# Altium project Placa adaptadora TMS320F28335.PrjPcb
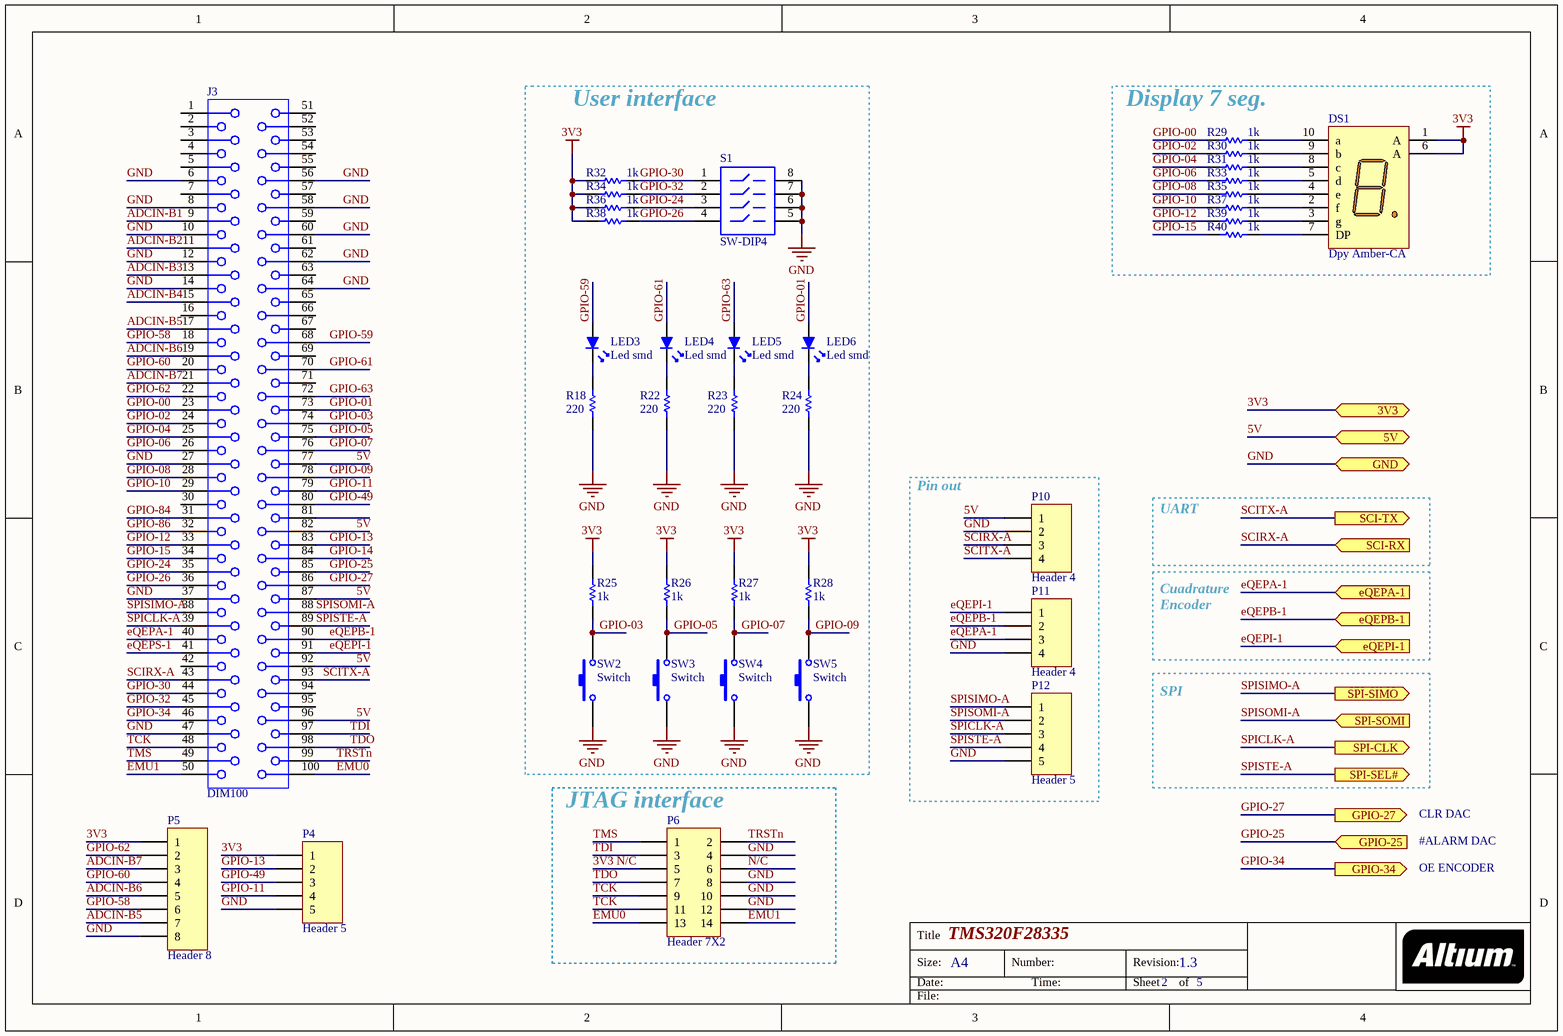
[diagram p0: TMS320F28335.SchDoc]
4 sheets, 107 parts. Net scope: flat (ports and power ports of the same name join across sheets).
Board file: Placa adaptadora TMS320F28335 - PCB.PcbDoc
Sheets:
  TMS320F28335.SchDoc
  Encoder.SchDoc
  DAC.SchDoc
  SupplyPower.SchDoc

## Sheet TMS320F28335.SchDoc: TMS320F28335
size A4; Author: Anderson, Jorge Luis; CompanyName: LEICI - FI-UNLP; Revision: 1.3; SheetNumber: 2; SheetTotal: 5; Number: 1; ProjectName: Placa adaptadora TMS320F28835

### Parts
DS1  Dpy Amber-CA  [A]
J3  DIM100  [390213-1]
LED3  Led smd  [LED 1206]
LED4  Led smd  [LED 1206]
LED5  Led smd  [LED 1206]
LED6  Led smd  [LED 1206]
P4  Header 5  [HDR1X5]
P5  Header 8  [HDR1X8]
P6  Header 7X2  [HDR2X7]
P10  Header 4  [HDR1X4]
P11  Header 4  [HDR1X4]
P12  Header 5  [HDR1X5]
R18  value 220  [R 1206]  (hidden comment: R220)
R22  value 220  [R 1206]  (hidden comment: R220)
R23  value 220  [R 1206]  (hidden comment: R220)
R24  value 220  [R 1206]  (hidden comment: R220)
R25  value 1k  [R 1206]  (hidden comment: R1k)
R26  value 1k  [R 1206]  (hidden comment: R1k)
R27  value 1k  [R 1206]  (hidden comment: R1k)
R28  value 1k  [R 1206]  (hidden comment: R1k)
R29  value 1k  [R 1206]  (hidden comment: R1k)
R30  value 1k  [R 1206]  (hidden comment: R1k)
R31  value 1k  [R 1206]  (hidden comment: R1k)
R32  value 1k  [R 1206]  (hidden comment: R1k)
R33  value 1k  [R 1206]  (hidden comment: R1k)
R34  value 1k  [R 1206]  (hidden comment: R1k)
R35  value 1k  [R 1206]  (hidden comment: R1k)
R36  value 1k  [R 1206]  (hidden comment: R1k)
R37  value 1k  [R 1206]  (hidden comment: R1k)
R38  value 1k  [R 1206]  (hidden comment: R1k)
R39  value 1k  [R 1206]  (hidden comment: R1k)
R40  value 1k  [R 1206]  (hidden comment: R1k)
S1  SW-DIP4  [DIP-8]
SW2  Switch  [TACT SW]
SW3  Switch  [TACT SW]
SW4  Switch  [TACT SW]
SW5  Switch  [TACT SW]

### Blocks framed on the sheet
User interface: LED3-LED6 R18 R22-R28 R32 R34 R36 R38 S1 SW2-SW5
Display 7 seg.: DS1 R29-R31 R33 R35 R37 R39 R40
Pin out: P10-P12
JTAG interface: P6

### Ports
3V3, 5V, eQEPA-1 (in), eQEPB-1 (in), eQEPI-1 (in), GND, GPIO-25 (in), GPIO-27 (out), GPIO-34 (out), SCI-RX (in), SCI-TX (out), SPI-CLK (out), SPI-SEL# (out), SPI-SIMO (out), SPI-SOMI (in)

### Nets
3V3: DS1.1(A) DS1.6(A) P4.1 P5.1 R25.2 R26.2 R27.2 R28.2 R32.1 R34.1 R36.1 R38.1 ; port 3V3
5V: J3.77(p77) J3.82(p82) J3.87(p87) J3.92(p92) J3.96(p96) P10.1 ; port 5V
GND: J3.6(p6) J3.8(p8) J3.10(p10) J3.12(p12) J3.14(p14) J3.27(p27) J3.37(p37) J3.47(p47) J3.56(p56) J3.58(p58) J3.60(p60) J3.62(p62) J3.64(p64) P4.5 P5.8 P6.4 P6.8 P6.10 P6.12 P10.2 P11.4 P12.5 R18.2 R22.2 R23.2 R24.2 S1.5 S1.6 S1.7 S1.8 SW2.1 SW3.1 SW4.1 SW5.1 ; port GND
3V3 N/C: P6.5
ADCIN-B1: J3.9(p9)
ADCIN-B2: J3.11(p11)
ADCIN-B3: J3.13(p13)
ADCIN-B4: J3.15(p15)
ADCIN-B5: J3.17(p17) P5.7
ADCIN-B6: J3.19(p19) P5.5
ADCIN-B7: J3.21(p21) P5.3
EMU0: J3.100(p100) P6.13
EMU1: J3.50(p50) P6.14
eQEPA-1: J3.40(p40) P11.3 ; port eQEPA-1
eQEPB-1: J3.90(p90) P11.2 ; port eQEPB-1
eQEPI-1: J3.91(p91) P11.1 ; port eQEPI-1
eQEPS-1: J3.41(p41)
GPIO-00: J3.23(p23) R29.1
GPIO-01: J3.73(p73) LED6.1(A)
GPIO-02: J3.24(p24) R30.1
GPIO-03: J3.74(p74) R25.1 SW2.2
GPIO-04: J3.25(p25) R31.1
GPIO-05: J3.75(p75) R26.1 SW3.2
GPIO-06: J3.26(p26) R33.1
GPIO-07: J3.76(p76) R27.1 SW4.2
GPIO-08: J3.28(p28) R35.1
GPIO-09: J3.78(p78) R28.1 SW5.2
GPIO-10: J3.29(p29) R37.1
GPIO-11: J3.79(p79) P4.4
GPIO-12: J3.33(p33) R39.1
GPIO-13: J3.83(p83) P4.2
GPIO-14: J3.84(p84)
GPIO-15: J3.34(p34) R40.1
GPIO-24: J3.35(p35) R36.2 S1.3
GPIO-25: J3.85(p85) ; port GPIO-25
GPIO-26: J3.36(p36) R38.2 S1.4
GPIO-27: J3.86(p86) ; port GPIO-27
GPIO-30: J3.44(p44) R32.2 S1.1
GPIO-32: J3.45(p45) R34.2 S1.2
GPIO-34: J3.46(p46) ; port GPIO-34
GPIO-49: J3.80(p80) P4.3
GPIO-58: J3.18(p18) P5.6
GPIO-59: J3.68(p68) LED3.1(A)
GPIO-60: J3.20(p20) P5.4
GPIO-61: J3.70(p70) LED4.1(A)
GPIO-62: J3.22(p22) P5.2
GPIO-63: J3.72(p72) LED5.1(A)
GPIO-84: J3.31(p31)
GPIO-86: J3.32(p32)
N/C: P6.6
SCIRX-A: J3.43(p43) P10.3 ; port SCI-RX
SCITX-A: J3.93(p93) P10.4 ; port SCI-TX
SPICLK-A: J3.39(p39) P12.3 ; port SPI-CLK
SPISIMO-A: J3.38(p38) P12.1 ; port SPI-SIMO
SPISOMI-A: J3.88(p88) P12.2 ; port SPI-SOMI
SPISTE-A: J3.89(p89) P12.4 ; port SPI-SEL#
TCK: J3.48(p48) P6.9 P6.11
TDI: J3.97(p97) P6.3
TDO: J3.98(p98) P6.7
TMS: J3.49(p49) P6.1
TRSTn: J3.99(p99) P6.2
NetDS1_2: DS1.2(f) R37.2
NetDS1_3: DS1.3(g) R39.2
NetDS1_4: DS1.4(e) R35.2
NetDS1_5: DS1.5(d) R33.2
NetDS1_7: DS1.7(DP) R40.2
NetDS1_8: DS1.8(c) R31.2
NetDS1_9: DS1.9(b) R30.2
NetDS1_10: DS1.10(a) R29.2
NetLED3_2: LED3.2(K) R18.1
NetLED4_2: LED4.2(K) R22.1
NetLED5_2: LED5.2(K) R23.1
NetLED6_2: LED6.2(K) R24.1

Not connected (* = marked no-connect by the designer): J3 1(p1) 2(p2) 3(p3) 4(p4) 5(p5) 7(p7) 16(p16) 30(p30) 42(p42) 51(p51) 52(p52) 53(p53) 54(p54) 55(p55) 57(p57) 59(p59) 61(p61) 63(p63) 65(p65) 66(p66) 67(p67) 69(p69) 71(p71) 81(p81) 94(p94) 95(p95)

### Notes on the sheet
- UART
- Cuadrature Encoder
- SPI
- #ALARM DAC
- CLR DAC
- OE ENCODER
- Title
- Size:
- Date:
- A4
- Number:
- Time:
- Revision:
- Sheet
- of
- File:

### Library data of the parts
DS1 = Dpy Amber-CA: 7.62 mm Black Surface Orange 7-Segment Display: CA, RH DP; MinimumIntensity: 354 ucd; Note: IF = 5 mA; Note: Pins 1 and 6 are redundant Anodes.; Published: 8-Jun-2000; LatestRevisionDate: 17-Dec-2003; LatestRevisionNote: Schematic revised, PCB Footprint replaced.; DatasheetVersion: 19-Feb-2002; PackageVersion: 11-Feb-2002; PackageReference: A; Publisher: Altium Limited; PackageDescription: LED, 7-Segment Display, 7.62 mm, RHD; 10 Leads; Row Space 5.08 mm; Pitch 2.54 mm; Colour: Orange; ComponentLink1Description: Manufacturer Link; ComponentLink1URL: http://www.agilent.com/
J3 = 390213-1: Vertical, DIMM 2P Low Insertion Force, 100 Position; Positions: 100; Rows: Dual; InsertionStyle: Direct Insert; EjectorLocation: Both Ends; PCB_Layout: Complies with manufacturer's recommendation.; DrillSize: Corresponds to nominal value.; Published: 15-Jun-2001; LatestRevisionDate: 17-Jul-2002; LatestRevisionNote: Re-released for DXP Platform.; DatasheetDocument: 21-Apr-1999; PackageDocument: 21-Apr-1999; PackageReference: 390213-1; Publisher: Altium Limited; Orientation: Vertical; ComponentLink1Description: Manufacturer Link; ComponentLink1URL: http://www.tycoelectronics.com/; ComponentLink2Description: Packaging Specification; ComponentLink2URL: http://ecommas.tycoelectronics.com/commerce/DocumentDelivery/DDEController?Action=showdoc&DocId=Customer+Drawing%7F390213%7FG%7Ftif%7FEnglish%7FENG_CD_390213_G.tif
LED3 LED5 = LED: Led green; .Creator: SR; .PCBCheck: Used; .SCHCheck: Used
LED4 LED6 = LED: Led yellow; .Creator: SR; .PCBCheck: Used; .SCHCheck: Used
P4 P12 = Header 5: Header, 5-Pin; LatestRevisionDate: 17-Jul-2002; LatestRevisionNote: Re-released for DXP Platform.; Publisher: Altium Limited
P5 = Header 8: Header, 8-Pin; LatestRevisionDate: 17-Jul-2002; LatestRevisionNote: Re-released for DXP Platform.; Publisher: Altium Limited
P6 = Header 7X2: Header, 7-Pin, Dual row; LatestRevisionDate: 17-Jul-2002; LatestRevisionNote: Re-released for DXP Platform.; Publisher: Altium Limited
P10 P11 = Header 4: Header, 4-Pin; LatestRevisionDate: 17-Jul-2002; LatestRevisionNote: Re-released for DXP Platform.; Publisher: Altium Limited
R18 R22-R40 = R: Resistencia; .Creator: SR; .PCBCheck: Used; .SCHCheck: Used; Category: Resistencias
S1 = SW-DIP4: DIP Switch; Published: 24-Mar-1999; LatestRevisionDate: 17-Jul-2002; LatestRevisionNote: Re-released for DXP Platform.; PackageReference: DIP-8; Publisher: Altium Limited
SW2-SW5 = Pulsador NA 4 term: .Creator: G; .PCBCheck: G; .SCHCheck: G

## Sheet Encoder.SchDoc: Acondicionamiento Encoder
size A4; Author: Anderson, Jorge.; CompanyName: LEICI - FI-UNLP; DocumentNumber: 1; Revision: 1.1; SheetNumber: 3; SheetTotal: 5; PageSetup: Record=PageOptions|CenterHorizontal=True|CenterVertical=True|PrintScale=1.00|XCorrection=1.00|YCorrection=1.00|PrintKind=0|BorderSize=5000000|LeftOffset=0|BottomOffset=0|Orientation=2|PaperLength=1000|PaperWidth=1000|Scale=100|PaperSource=7|PrintQuality=-3|MediaType=1|DitherType=10|PrintScaleMode=1|PaperKind=A4|PaperIndex=9; ProjectName: Placa Adaptadora TMS320F28335
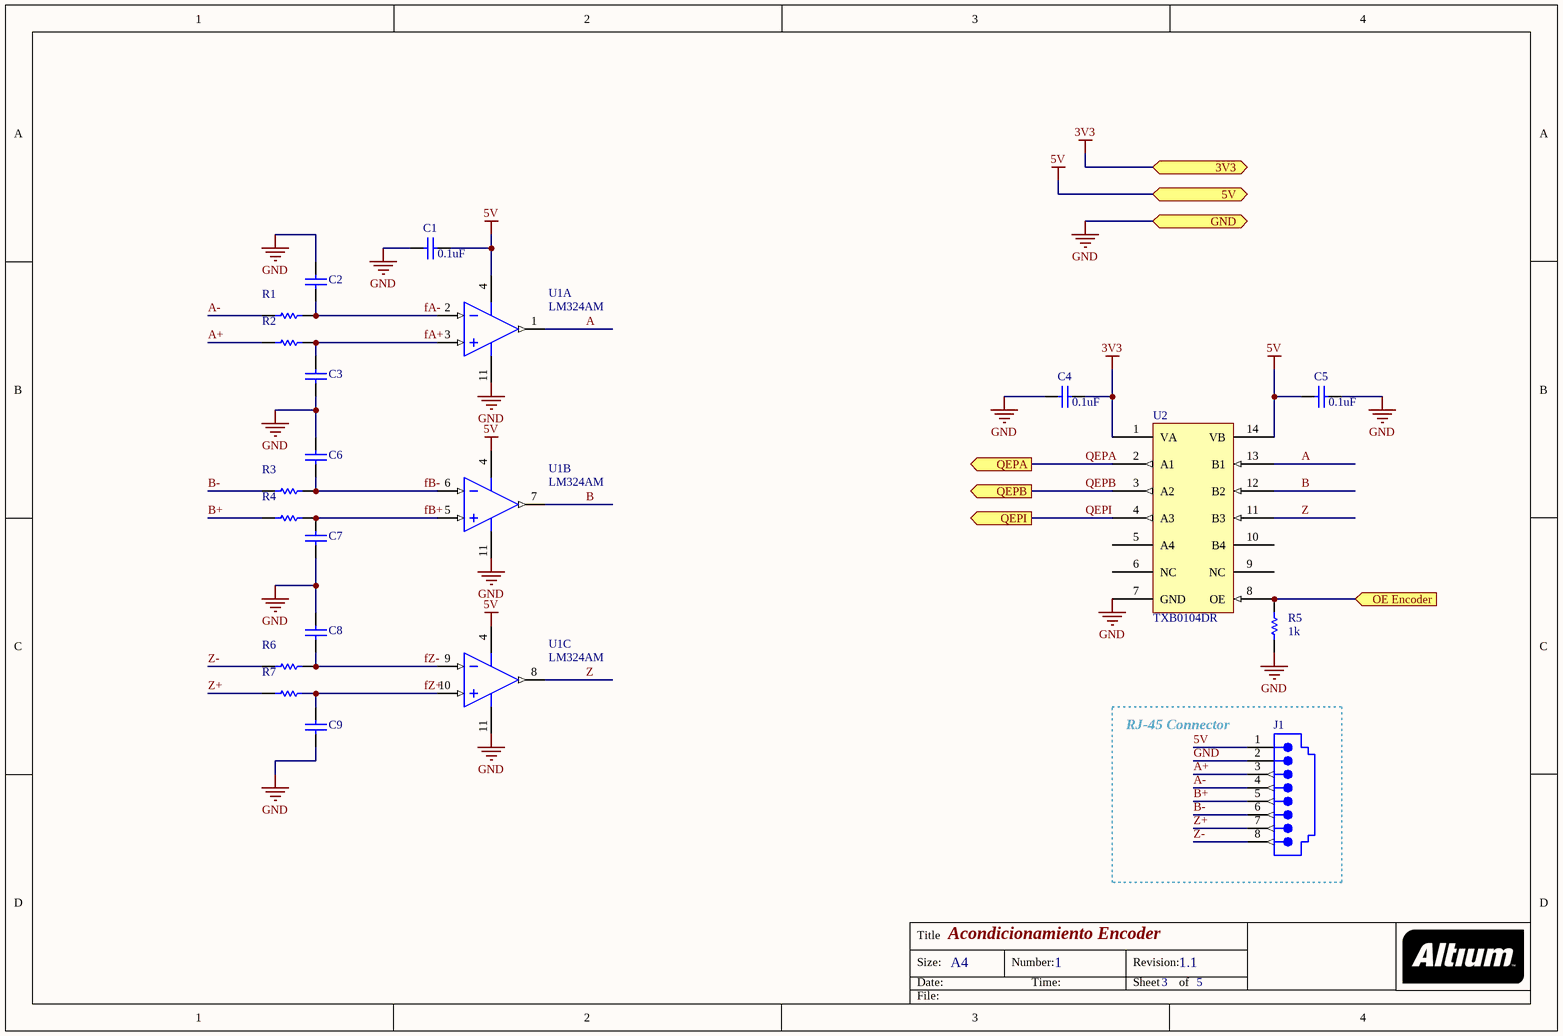
[diagram p1: Encoder.SchDoc]

### Parts
C1  value 0.1uF  [C 1206]  (hidden comment: C0.1u)
C2  C?  [C 1206]  (value not drawn)
C3  C?  [C 1206]  (value not drawn)
C4  value 0.1uF  [C 1206]  (hidden comment: C0.1u)
C5  value 0.1uF  [C 1206]  (hidden comment: C0.1u)
C6  C?  [C 1206]  (value not drawn)
C7  C?  [C 1206]  (value not drawn)
C8  C?  [C 1206]  (value not drawn)
C9  C?  [C 1206]  (value not drawn)
J1  RJ-45 connector  [15-43-6588]  (value not drawn)
R1  R?  [R 1206]  (value not drawn)
R2  R?  [R 1206]  (value not drawn)
R3  R?  [R 1206]  (value not drawn)
R4  R?  [R 1206]  (value not drawn)
R5  value 1k  [R 1206]  (hidden comment: R1k)
R6  R?  [R 1206]  (value not drawn)
R7  R?  [R 1206]  (value not drawn)
U1  LM324AM  [M14A_N]  (parts A,B,C of 4)
U2  TXB0104DR  [SOIC-14]

### Blocks framed on the sheet
RJ-45 Connector: J1

### Ports
3V3, 5V, GND, OE Encoder (in), QEPA (out), QEPB (out), QEPI (out)

### Nets
3V3: C4.2 U2.1(VA) ; port 3V3
5V: C1.2 C5.1 J1.1 U1.4(V+) U2.14(VB) ; port 5V
GND: C1.1 C2.2 C3.1 C4.1 C5.2 C6.2 C7.1 C8.2 C9.1 J1.2 R5.1 U1.11(GND) U2.7(GND) ; port GND
A: U1.1(OUT1) U2.13(B1)
A+: J1.3 R2.2
A-: J1.4 R1.2
B: U1.7(OUT2) U2.12(B2)
B+: J1.5 R4.2
B-: J1.6 R3.2
fA+: C3.2 R2.1 U1.3(IN1+)
fA-: C2.1 R1.1 U1.2(IN1-)
fB+: C7.2 R4.1 U1.5(IN2+)
fB-: C6.1 R3.1 U1.6(IN2-)
fZ+: C9.2 R7.1 U1.10(IN3+)
fZ-: C8.1 R6.1 U1.9(IN3-)
QEPA: U2.2(A1) ; port QEPA
QEPB: U2.3(A2) ; port QEPB
QEPI: U2.4(A3) ; port QEPI
Z: U1.8(OUT3) U2.11(B3)
Z+: J1.7 R7.2
Z-: J1.8 R6.2
NetR5_2: R5.2 U2.8(OE) ; port OE Encoder

Not connected (* = marked no-connect by the designer): U2 5(A4) 6(NC) 9(NC) 10(B4)

### Notes on the sheet
- Title
- Size:
- Date:
- A4
- Number:
- Time:
- Revision:
- Sheet
- of
- File:

### Library data of the parts
C1-C9 = C: Capacitor; .PCBCheck: Used; .Creator: SR; .SCHCheck: Used; Category: Capacitores
J1 = 15-43-6588: RJ-45 connector, 8-pins, ethernet; Ports: 1; Positions/Loaded: Port1 - 8/8; PerformanceCategory: 3; PCB_Mounting: Thru-Hole; ComponentAvailability: Obsolete; DrillSize: Nominal, Rounded to nearest 0.05mm; PCB_Layout: Complies with Manufacturer's Recommendation.; Published: 25-Jun-2002; DatasheetDocument: 18-Dec-2001; PackageDocument: 18-Dec-2001; PackageReference: 15-43-6588; Publisher: Altium Limited; ComponentLink1Description: Manufacturer Link; ComponentLink1URL: http://www.molex.com/; ComponentLink2Description: Datasheet; ComponentLink2URL: http://www.molex.com/cmc_upload/common_files/1212003_catalogmx41314.pdf; ComponentLink3Description: Iges Model; ComponentLink3URL: http://www.molex.com/pdm_docs/igs/15-43-6233_igs.zip
R1-R7 = R: as R18 on sheet TMS320F28335; .SCHCheck: Used; Category: Resistencias
U1 = LM324AM: Low Power Quad Operational Amplifier, 14-pin Narrow SOIC; Manufacturer: National Semiconductor; PackageTopMarking: NSUZXYTTE#*LM324AM; PowerWise: N; CompType: Amplifiers; High-Reliability: Y; DatasheetVersion: Aug-2000; PackageVersion: revJ, Jan-1996; PackageReference: M14A; PackageDescription: Molded Package S.O., .150in Wide, 14 Lead; PartNumber: LM324AM; RoHS: N; PinCount: 14; Code_JEDEC: MS-012AB; Code_IPC: SOIC127P600-14; ComponentLink1Description: Manufacturer URL; ComponentLink1URL: http://www.national.com/; ComponentLink2Description: LM324 Datasheet; ComponentLink2URL: http://www.national.com/ds/LM/LM324.pdf; ComponentLink3Description: LM324 Web Page; ComponentLink3URL: http://www.national.com/pf/LM/LM324.html; ComponentLink4Description: M14A Package Page; ComponentLink4URL: http://www.national.com/packaging/folders/m14a.html
U2 = TXB0104DR: IC VOLT-LEVEL TRANSLATOR 14-SOIC; Manufacturer: Texas Instruments; Logic Function: Translator, Bidirectional; Number of Bits: 4; Input Type: Logic; Data Rate: 100Mbps; Number of Outputs/Channel: 1; Differential - Input:Output: No/No; Propagation Delay (Max): 4ns; Voltage - Supply: 1.2 V ~ 3.6 V, 1.65 V ~ 5.5 V; Supplier 1: Digi-Key; Manufacturer Part Number: TXB0104DR; RoHS: RoHS Compliant; Category: Integrated Circuits (ICs); Stock 1: 15688; Pricing 1: 1=1.69, 10=1.493, 25=1.348, 100=1.1794, 250=1.03428, 500=0.91728, 750=0.80028, 1000=0.7254 (USD); Packaging: Cut Tape (CT); Output Type: Logic; Number of Channels: 4; Operating Temperature: -40°C ~ 85°C; Package / Case: 14-SOIC (0.154", 3.90mm Width); Supplier Device Package: 14-SOIC; Mounting Type: Surface Mount; ComponentLink1URL: http://www.ti.com/lit/ds/symlink/txb0104.pdf; ComponentLink1Description: http://www.ti.com/lit/ds/symlink/txb0104.pdf; Supplier Part Number 1: 296-21928-1-ND

## Sheet DAC.SchDoc: DAC
size A4; Author: Anderson, Jorge; CompanyName: LEICI - FI-UNLP; Revision: 1.1; SheetNumber: 5; SheetTotal: 5; Time: 0; ProjectName: Placa adaptadora TMS320F28335
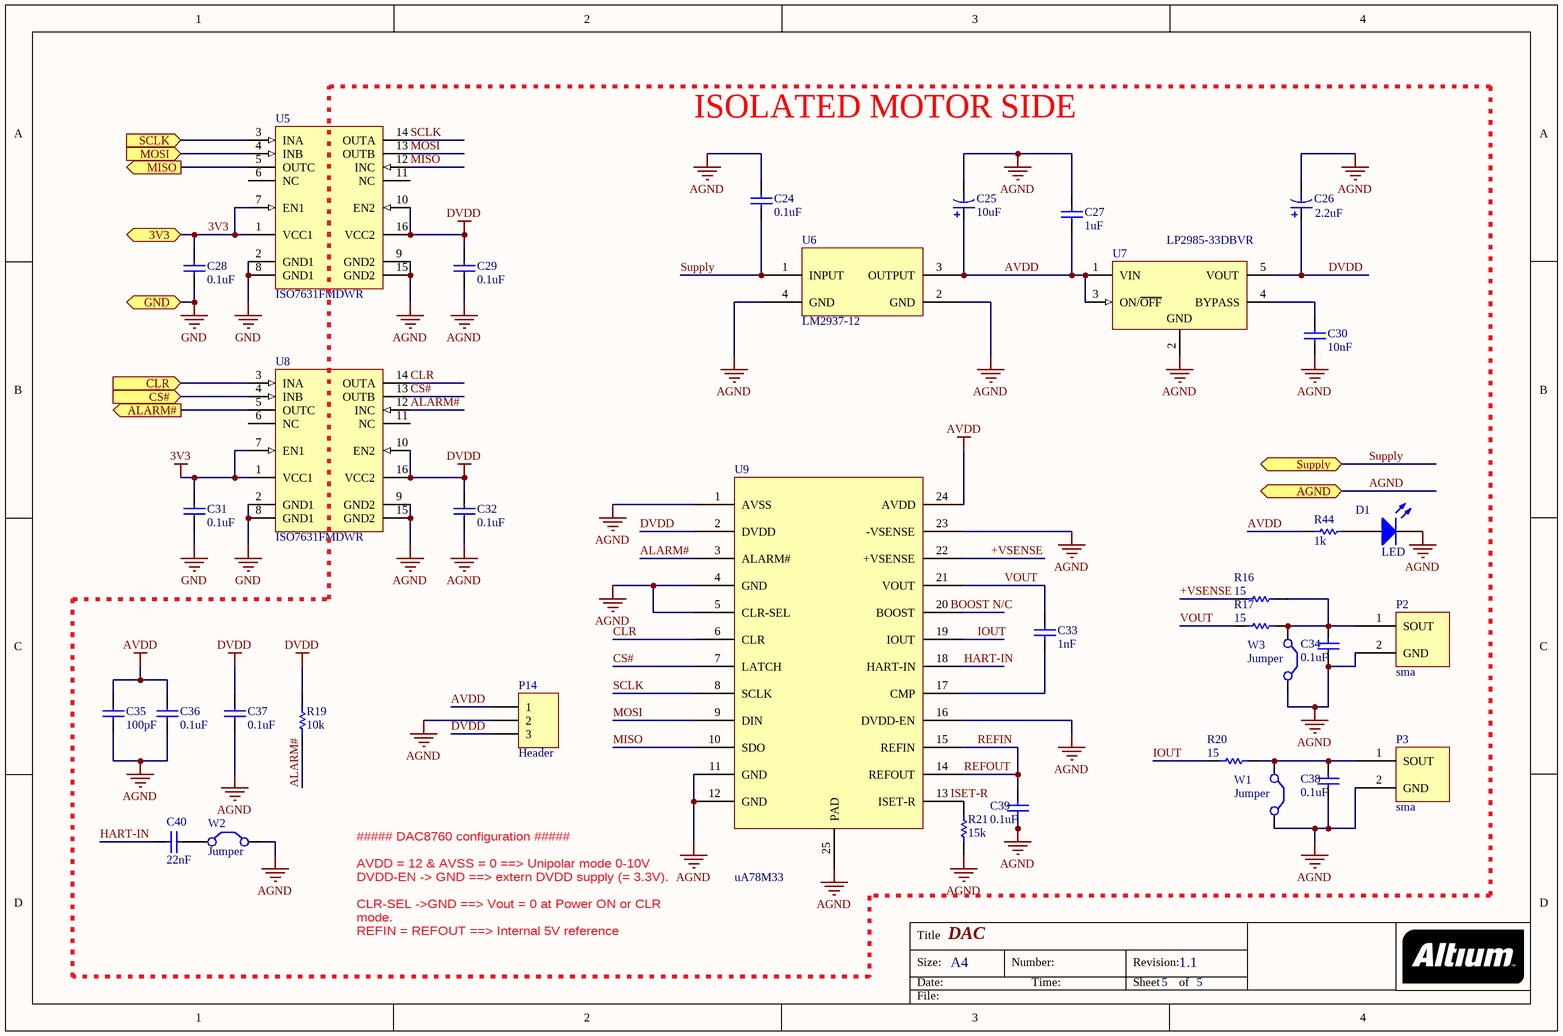
[diagram p2: DAC.SchDoc]

### Parts
C24  value 0.1uF  [C 1206]  (hidden comment: C0.1u)
C25  value 10uF  [Almn cap]  (hidden comment: C10u)
C26  value 2.2uF  [Tantalum]  (hidden comment: CT2.2u)
C27  value 1uF  [0805]  (hidden comment: C1u)
C28  value 0.1uF  [C 1206]  (hidden comment: C0.1u)
C29  value 0.1uF  [C 1206]  (hidden comment: C0.1u)
C30  value 10nF  [C 1206]  (hidden comment: C10n)
C31  value 0.1uF  [C 1206]  (hidden comment: C0.1u)
C32  value 0.1uF  [C 1206]  (hidden comment: C0.1u)
C33  value 1nF  [C 1206]  (hidden comment: C1n)
C34  value 0.1uF  [C 1206]  (hidden comment: C0.1u)
C35  value 100pF  [C 1206]  (hidden comment: C100p)
C36  value 0.1uF  [C 1206]  (hidden comment: C0.1u)
C37  value 0.1uF  [C 1206]  (hidden comment: C0.1uF)
C38  value 0.1uF  [C 1206]  (hidden comment: C0.1u)
C39  value 0.1uF  [C 1206]  (hidden comment: C0.1u)
C40  value 22nF  [C 1206]  (hidden comment: C22n)
D1  LED  [LED-1]
P2  sma  [sma]
P3  sma  [sma]
P14  Header  [HDR1X3]
R16  value 15  [R 1206]  (hidden comment: R15)
R17  value 15  [R 1206]  (hidden comment: R15)
R19  value 10k  [R 1206]  (hidden comment: R10k)
R20  value 15  [R 1206]  (hidden comment: R15)
R21  value 15k  [R 1206]  (hidden comment: R15k)
R44  value 1k  [R 1206]  (hidden comment: R15k)
U5  ISO7631FMDWR  [DW0016A_N]
U6  LM2937-12  [DCY4]
U7  LP2985-33DBVR  [TI-DBV5_N]
U8  ISO7631FMDWR  [DW0016A_N]
U9  uA78M33  [PWP]
W1  Jumper  [Jumper]
W2  Jumper  [Jumper]
W3  Jumper  [Jumper]

### Blocks framed on the sheet
ISOLATED MOTOR SIDE: C24-C27 C29 C30 C32-C40 D1 P2 P3 P14 R16 R17 R19-R21 R44 U5-U9 W1-W3

### Ports
3V3, AGND, ALARM# (out), CLR (in), CS# (in), GND, MISO (out), MOSI (in), SCLK (in), Supply

### Nets
3V3: C28.1 C31.1 U5.1(VCC1) U5.7(EN1) U8.1(VCC1) U8.7(EN1) ; port 3V3
AGND: C24.1 C25.2 C26.2 C27.1 C29.2 C30.2 C32.2 C34.2 C35.2 C36.2 C37.2 C38.2 C39.2 D1.2(K) P2.2(GND) P3.2(GND) P14.2 R21.2 U5.9(GND2) U5.15(GND2) U6.2(GND) U6.4(GND) U7.2(GND) U8.9(GND2) U8.15(GND2) U9.1(AVSS) U9.4(GND) U9.5(CLR-SEL) U9.11(GND) U9.12(GND) U9.16(DVDD-EN) U9.23(-VSENSE) U9.25(PAD) W1.2(C2) W2.2(C2) W3.2(C2) ; port AGND
AVDD: C25.1 C27.2 C35.1 C36.1 P14.1 R44.2 U6.3(OUTPUT) U7.1(VIN) U7.3(ON/~{OFF}) U9.24(AVDD)
DVDD: C26.1 C29.1 C32.1 C37.1 P14.3 R19.1 U5.10(EN2) U5.16(VCC2) U7.5(VOUT) U8.10(EN2) U8.16(VCC2) U9.2(DVDD)
GND: C28.2 C31.2 U5.2(GND1) U5.8(GND1) U8.2(GND1) U8.8(GND1) ; port GND
+VSENSE: R16.2 U9.22(+VSENSE)
ALARM#: R19.2 U8.12(INC) U9.3(ALARM#)
CLR: U8.14(OUTA) U9.6(CLR)
CS#: U8.13(OUTB) U9.7(LATCH)
HART-IN: C40.1 U9.18(HART-IN)
IOUT: R20.2 U9.19(IOUT)
MISO: U5.12(INC) U9.10(SDO)
MOSI: U5.13(OUTB) U9.9(DIN)
REFIN: C39.1 U9.14(REFOUT) U9.15(REFIN)  [also labelled REFOUT]
SCLK: U5.14(OUTA) U9.8(SCLK)
Supply: C24.2 U6.1(INPUT) ; port Supply
VOUT: C33.1 R17.2 U9.21(VOUT)
NetC30_1: C30.1 U7.4(BYPASS)
NetC33_2: C33.2 U9.17(CMP)
NetC34_1: C34.1 P2.1(SOUT) R16.1 R17.1 W3.1(C1)
NetC38_1: C38.1 P3.1(SOUT) R20.1 W1.1(C1)
NetC40_2: C40.2 W2.1(C1)
NetD1_1: D1.1(A) R44.1
NetR21_1: R21.1 U9.13(ISET-R)
NetU5_3: U5.3(INA) ; port SCLK
NetU5_4: U5.4(INB) ; port MOSI
NetU5_5: U5.5(OUTC) ; port MISO
NetU8_3: U8.3(INA) ; port CLR
NetU8_4: U8.4(INB) ; port CS#
NetU8_5: U8.5(OUTC) ; port ALARM#

Not connected (* = marked no-connect by the designer): U5 6(NC) 11(NC); U8 6(NC) 11(NC); U9 20(BOOST)

### Notes on the sheet
- ##### DAC8760 configuration #####
  AVDD = 12 & AVSS = 0 ==> Unipolar mode 0-10V
  DVDD-EN -> GND ==> extern DVDD supply (= 3.3V).
  CLR-SEL ->GND ==> Vout = 0 at Power ON or CLR mode.
  REFIN = REFOUT ==> Internal 5V reference
- Labels drawn without touching a wire or pin: BOOST N/C, ISET-R
- Title
- Size:
- Date:
- A4
- Number:
- Time:
- Revision:
- Sheet
- of
- File:

### Library data of the parts
C24 C27-C40 = C: Capacitor; .PCBCheck: Used; .Creator: SR; .SCHCheck: Used; Category: Capacitores
C25 = Capacitor pol: Capacitor polarzado
C26 = C Tantalum: Tantalum capacitor
D1 = LED1: Typical RED GaAs LED; Published: 8-Jun-2000; LatestRevisionDate: 08-Jul-2005; LatestRevisionNote: Mech Layer 1 removed.; PackageReference: LED-1; Publisher: Altium Limited; PackageDescription: LED; 2 Leads
P14 = Header 3: Header, 3-Pin; LatestRevisionDate: 17-Jul-2002; LatestRevisionNote: Re-released for DXP Platform.; Publisher: Altium Limited
R16 R17 R19-R21 R44 = R: as R18 on sheet TMS320F28335; .SCHCheck: Used; Category: Resistencias
U5 U8 = ISO7641FMDWR: 150 Mbps 6 kVpk Low Power Quad Channels, Digital Isolator, 2.7 V / 3.3 V / 5 V, -40 to +125 degC, 16-pin SOIC (DW), Green (RoHS & no Sb/Br); Manufacturer: Texas Instruments; Datarate(Mbps): 150; Input Noise Filter: None; Insulation Rating(VRMS): 5000; Prop Delay(Max)(ns): 10.5; Rating: Catalog; Supply Voltage(s)(V): 2.7, 3.3, 5; TTL/CMOS Input Threshold: TTL; DatasheetVersion: SLLSE89C; PackageVersion: 4040000-2/G, 01/2011; PackageReference: DW0016A; PackageDescription: 16-Pin Plastic Small Outline, Body 10.30 x 7.50 mm, Pitch 1.27 mm; Supplier 1: Digi-Key; Supplier Part Number 1: 296-35966-2-ND; Supplier 2: Digi-Key; Supplier Part Number 2: 296-35966-1-ND; Supplier 3: Digi-Key; Supplier Part Number 3: 296-35966-6-ND; Supplier 4: Newark; Supplier Part Number 4: 70T7542; Supplier 5: Mouser; Supplier Part Number 5: 595-ISO7641FMDWR; Eco-Plan: Green (RoHS & no Sb/Br); Fail Safe: Low; SubFamily: Isolator; Thermal Shutdown: No; MountType: SMT; Code_JEDEC: MS-013; PartNumber: ISO7641FMDWR; ComponentLink1Description: Manufacturer URL; ComponentLink1URL: http://www.ti.com/; ComponentLink2Description: Datasheet; ComponentLink2URL: http://www.ti.com/general/docs/lit/getliterature.tsp?genericPartNumber=ISO7641FM&fileType=pdf; ComponentLink3Description: Package Specification; ComponentLink3URL: http://www.ti.com/litv/pdf/msoi003g; ComponentLink4Description: SamplesURL; ComponentLink4URL: http://www.ti.com/product/iso7641fm#samples
U6 = LM2937: Supplier 1: Newark; Supplier 2: Newark; Supplier Part Number 2: 41K4556
U7 = LP2985-10DBVR: Single Output Low Noise LDO, 150 mA, Fixed 3.3 V Output, 2.2 to 16 V Input, with Low IQ, 5-pin SOT-23 (DBV), -40 to 125 degC, Green (RoHS & no Sb/Br); Manufacturer: Texas Instruments; Accuracy(%): 1.5; Fixed Output Options(V): 3.3; Iout(Max)(A): 0.15; Iq(Typ)(mA): 0.85; SubFamily: Single Channel LDO; Vdo(Typ)(mV): 280; Vin(Max)(V): 16; Vin(Min)(V): 2.2; DatasheetVersion: SLVS522N; PackageVersion: 4073253-4/K; PackageReference: DBV5; PackageDescription: 5-Pin Plastic Small Outline, Body 1.60 Ã— 2.90 mm, Pitch 0.95 mm; Eco-Plan: Green (RoHS & no Sb/Br); Vout Adj(Max)(V): 3.3; Vout Adj(Min)(V): 3.3; Mounting Technology: Surface Mount; Code_JEDEC: MO-178; PartNumber: LP2985-33DBVR; ComponentLink1Description: Manufacturer URL; ComponentLink1URL: http://www.ti.com/; ComponentLink2Description: Datasheet; ComponentLink2URL: http://www.ti.com/general/docs/lit/getliterature.tsp?genericPartNumber=LP2985-10&fileType=pdf; ComponentLink3Description: Package Specification; ComponentLink3URL: http://www.ti.com/litv/pdf/mpds018i; Supplier 1: Farnell; Supplier Part Number 1: 2412118; Supplier 2: Digi-Key; Supplier Part Number 2: 296-18476-6-ND
U9 = DAC8760
W1-W3 = Jumper: Jumper Wire; Published: 24-Mar-1999; LatestRevisionDate: 17-Jul-2002; LatestRevisionNote: Re-released for DXP Platform.; PackageReference: RAD-0.2; Publisher: Altium Limited; PackageDescription: Radial Cap, Thru-Hole; 2 Leads; 0.2 in Pin Spacing
P2 P3 = sma: Supplier 1: Newark; Supplier 2: Newark; Supplier Part Number 2: 90F2624

## Sheet SupplyPower.SchDoc: Power Supply
size A4; Author: Anderson, Jorge; CompanyName: LEICI - FI-UNLP; Revision: 1.0; SheetNumber: 6; SheetTotal: 6; ProjectName: Placa adaptadora TMS320F28335
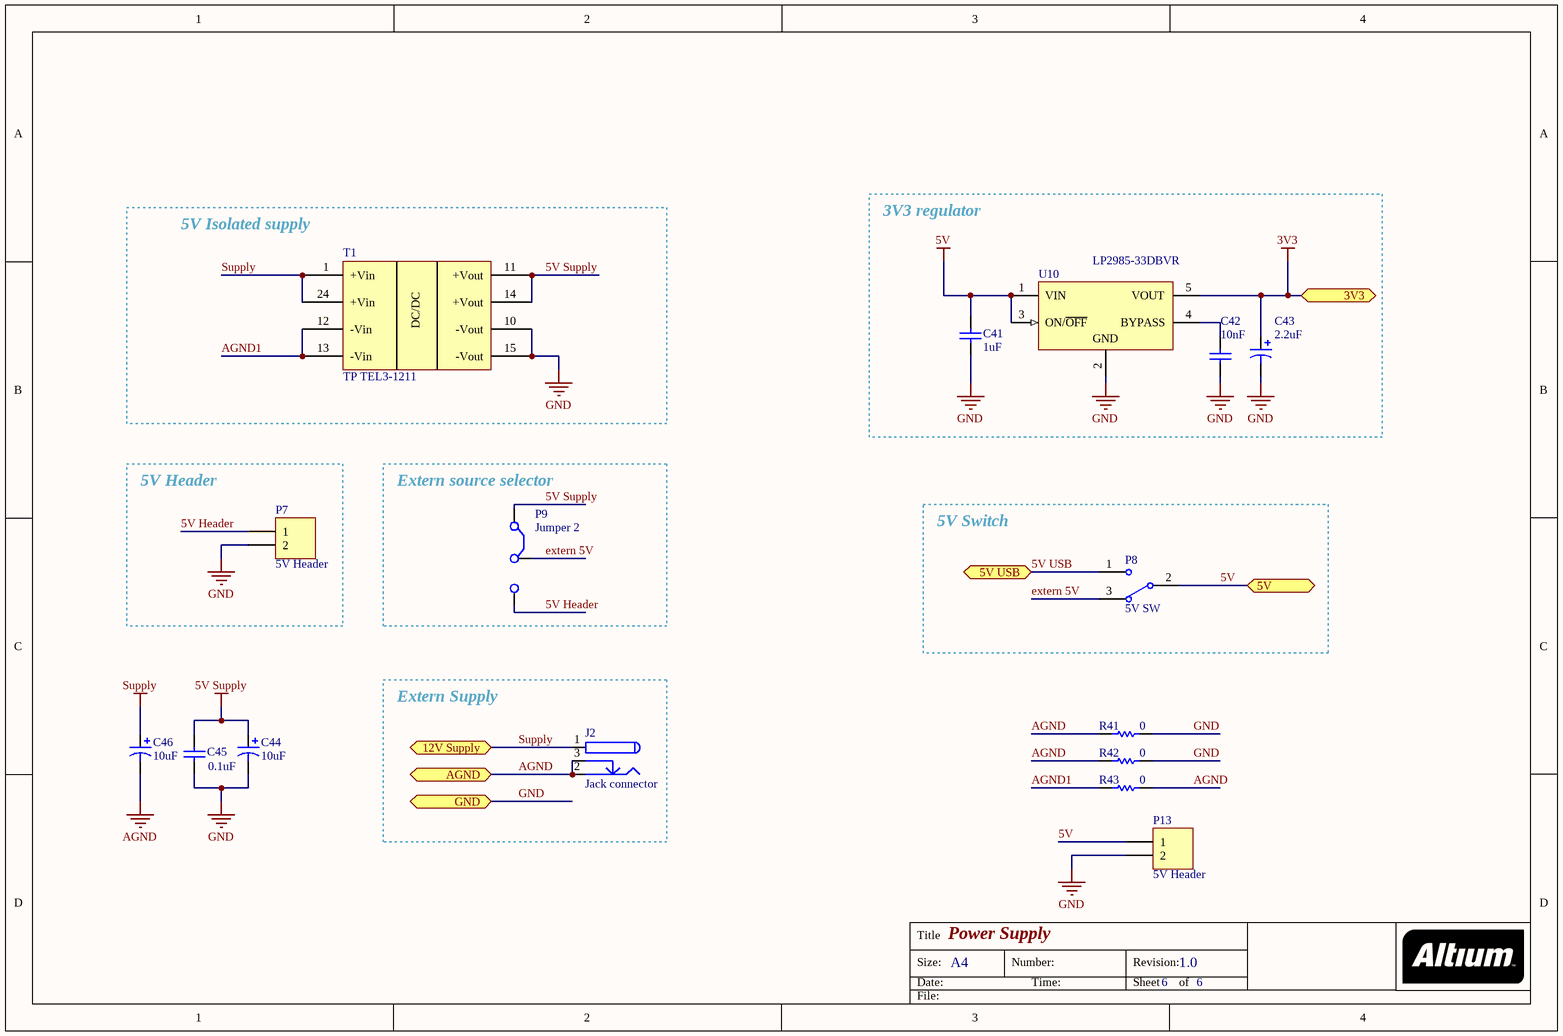
[diagram p3: SupplyPower.SchDoc]

### Parts
C41  value 1uF  [0805]  (hidden comment: C1u)
C42  value 10nF  [C 1206]  (hidden comment: C10n)
C43  value 2.2uF  [Tantalum]  (hidden comment: CT2.2u)
C44  value 10uF  [Almn cap]  (hidden comment: C10u)
C45  value 0.1uF  [C 1206]  (hidden comment: C0.1u)
C46  value 10uF  [CAP4x7x1.5mm]  (hidden comment: C10u)
J2  Jack connector
P7  5V Header  [HDR1X2]
P8  5V SW  [Toggle sw]
P9  Jumper 2  [Jumper 2]
P13  5V Header  [HDR1X2]
R41  value 0  [R 1206]  (hidden comment: R0)
R42  value 0  [R 1206]  (hidden comment: R0)
R43  value 0  [R 1206]  (hidden comment: R0)
T1  TP TEL3-1211
U10  LP2985-33DBVR  [TI-DBV5_N]

### Blocks framed on the sheet
3V3 regulator: C41-C43 U10
5V Isolated supply: T1
5V Header: P7
Extern source selector: P9
5V Switch: P8
Extern Supply: J2

### Ports
3V3, 5V, 5V USB, 12V Supply, AGND, GND

### Nets
3V3: C43.1 U10.5(VOUT) ; port 3V3
5V: C41.1 P8.2 P13.1 U10.1(VIN) U10.3(ON/~{OFF}) ; port 5V
5V Supply: C44.1 C45.2 P9.1(C1) T1.11(+Vout) T1.14(+Vout)
AGND: C46.2 J2.2 J2.3 R41.2 R42.2 R43.1 ; port AGND
GND: C41.2 C42.2 C43.2 C44.2 C45.1 P7.2 P13.2 R41.1 R42.1 T1.10(-Vout) T1.15(-Vout) U10.2(GND) ; port GND
Supply: C46.1 J2.1 T1.1(+Vin) T1.24(+Vin) ; port 12V Supply
5V Header: P7.1 P9.3(C3)
5V USB: P8.1 ; port 5V USB
AGND1: R43.2 T1.12(-Vin) T1.13(-Vin)
extern 5V: P8.3 P9.2(C2)
NetC42_1: C42.1 U10.4(BYPASS)

### Notes on the sheet
- Title
- Size:
- Date:
- A4
- Number:
- Time:
- Revision:
- Sheet
- of
- File:
- (in symbol TP TEL3-1211) DC/DC

### Library data of the parts
C41 C42 C45 = C: Capacitor; .PCBCheck: Used; .Creator: SR; .SCHCheck: Used; Category: Capacitores
C43 = C Tantalum: Tantalum capacitor
C44 C46 = Capacitor pol: Capacitor polarzado
P7 P13 = Header 2: Header, 2-Pin; LatestRevisionDate: 17-Jul-2002; LatestRevisionNote: Re-released for DXP Platform.; Publisher: Altium Limited
P8 = toggle sw
R41-R43 = R: as R18 on sheet TMS320F28335; .SCHCheck: Used; Category: Resistencias
U10 = LP2985-10DBVR: as U7 on sheet DAC; DatasheetVersion: SLVS522N; PackageVersion: 4073253-4/K; PackageReference: DBV5; PackageDescription: 5-Pin Plastic Small Outline, Body 1.60 Ã— 2.90 mm, Pitch 0.95 mm; Eco-Plan: Green (RoHS & no Sb/Br); Vout Adj(Max)(V): 3.3; Vout Adj(Min)(V): 3.3; Mounting Technology: Surface Mount; Code_JEDEC: MO-178; PartNumber: LP2985-33DBVR; ComponentLink1Description: Manufacturer URL; ComponentLink1URL: http://www.ti.com/; ComponentLink2Description: Datasheet; ComponentLink2URL: http://www.ti.com/general/docs/lit/getliterature.tsp?genericPartNumber=LP2985-10&fileType=pdf; ComponentLink3Description: Package Specification; ComponentLink3URL: http://www.ti.com/litv/pdf/mpds018i; Supplier 1: Farnell; Supplier Part Number 1: 2412118; Supplier 2: Digi-Key; Supplier Part Number 2: 296-18476-6-ND

## Nets that join several sheets
3V3: TMS320F28335 (12 pins), Encoder (C4.2 U2.1), DAC (6 pins), SupplyPower (C43.1 U10.5)
5V: TMS320F28335 (6 pins), Encoder (5 pins), SupplyPower (5 pins)
AGND: DAC (36 pins), SupplyPower (6 pins)
GND: TMS320F28335 (34 pins), Encoder (13 pins), DAC (6 pins), SupplyPower (12 pins)